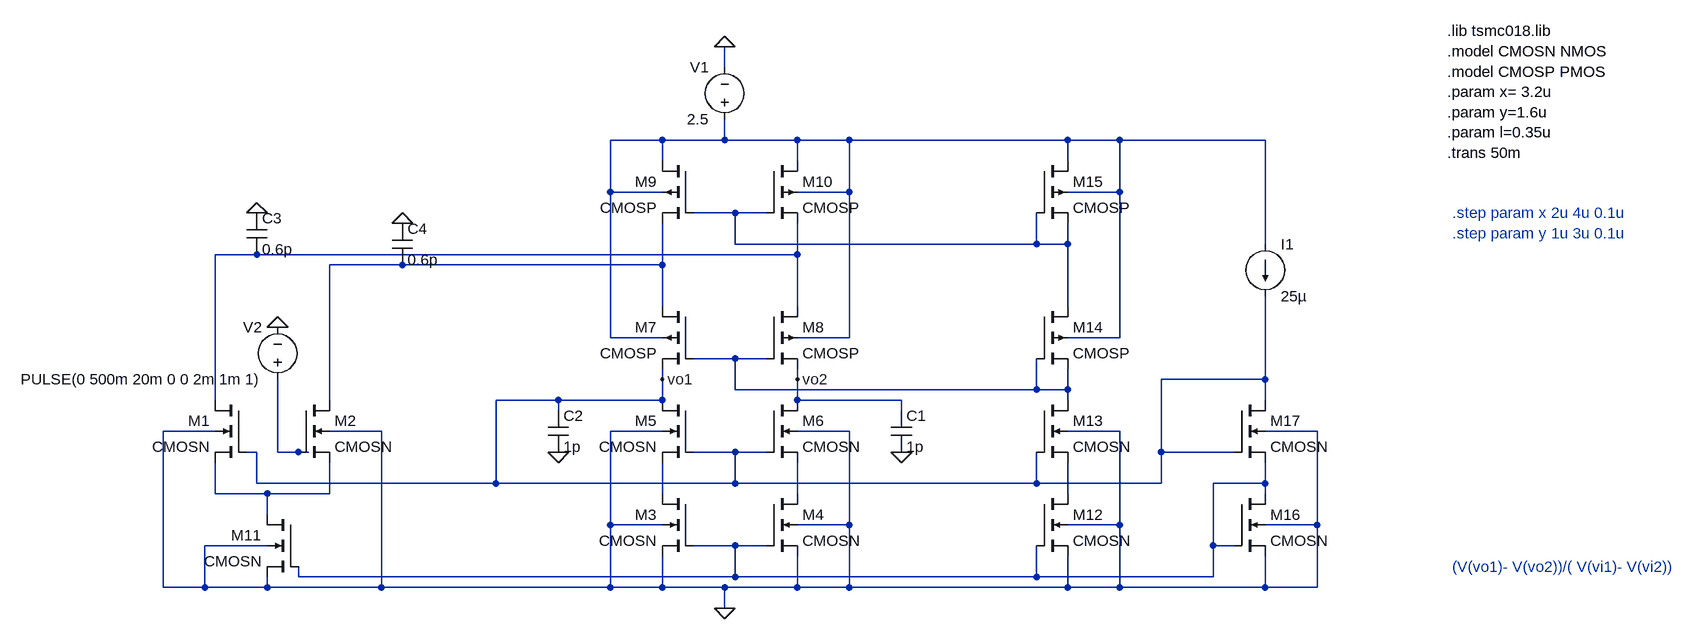
[diagram p0: schematic Draft1 - Slew.asc]
Draft1 - Slew.asc, the LTspice schematic file:
Version 4
SHEET 1 2420 2676
WIRE 624 -512 624 -544
WIRE 528 -400 448 -400
WIRE 624 -400 624 -432
WIRE 624 -400 528 -400
WIRE 736 -400 624 -400
WIRE 816 -400 736 -400
WIRE 1152 -400 816 -400
WIRE 1232 -400 1152 -400
WIRE 1456 -400 1232 -400
WIRE 528 -368 528 -400
WIRE 736 -368 736 -400
WIRE 1152 -368 1152 -400
WIRE 448 -320 448 -400
WIRE 528 -320 448 -320
WIRE 816 -320 816 -400
WIRE 816 -320 736 -320
WIRE 1232 -320 1232 -400
WIRE 1232 -320 1152 -320
WIRE 640 -288 576 -288
WIRE 688 -288 640 -288
WIRE 640 -240 640 -288
WIRE 1104 -240 1104 -288
WIRE 1104 -240 640 -240
WIRE 1152 -240 1152 -272
WIRE 1152 -240 1104 -240
WIRE 1456 -240 1456 -400
WIRE -96 -224 -160 -224
WIRE 736 -224 736 -272
WIRE 736 -224 -96 -224
WIRE 128 -208 16 -208
WIRE 528 -208 528 -272
WIRE 528 -208 128 -208
WIRE 528 -144 528 -208
WIRE 736 -144 736 -224
WIRE 1152 -144 1152 -240
WIRE 448 -96 448 -320
WIRE 528 -96 448 -96
WIRE 816 -96 816 -320
WIRE 816 -96 736 -96
WIRE 1232 -96 1232 -320
WIRE 1232 -96 1152 -96
WIRE 640 -64 576 -64
WIRE 688 -64 640 -64
WIRE 528 -32 528 -48
WIRE 736 -32 736 -48
WIRE 1456 -32 1456 -160
WIRE 1456 -32 1296 -32
WIRE 640 -16 640 -64
WIRE 1104 -16 1104 -64
WIRE 1104 -16 640 -16
WIRE 1152 -16 1152 -48
WIRE 1152 -16 1104 -16
WIRE -160 0 -160 -224
WIRE 16 0 16 -208
WIRE 368 0 272 0
WIRE 528 0 528 -32
WIRE 528 0 368 0
WIRE 736 0 736 -32
WIRE 896 0 736 0
WIRE 1152 0 1152 -16
WIRE 1456 0 1456 -32
WIRE 368 16 368 0
WIRE 736 16 736 0
WIRE 896 16 896 0
WIRE -160 48 -240 48
WIRE 96 48 16 48
WIRE 528 48 448 48
WIRE 816 48 736 48
WIRE 1232 48 1152 48
WIRE 1536 48 1456 48
WIRE -96 80 -112 80
WIRE -64 80 -64 -32
WIRE -32 80 -64 80
WIRE -16 80 -32 80
WIRE 640 80 576 80
WIRE 688 80 640 80
WIRE 1296 80 1296 -32
WIRE 1408 80 1296 80
WIRE -96 128 -96 80
WIRE 272 128 272 0
WIRE 272 128 -96 128
WIRE 640 128 640 80
WIRE 640 128 272 128
WIRE 1104 128 1104 80
WIRE 1104 128 640 128
WIRE 1296 128 1296 80
WIRE 1296 128 1104 128
WIRE 1456 128 1456 96
WIRE 1456 128 1376 128
WIRE -160 144 -160 96
WIRE -80 144 -160 144
WIRE 16 144 16 96
WIRE 16 144 -80 144
WIRE 528 144 528 96
WIRE 736 144 736 96
WIRE 1152 144 1152 96
WIRE 1456 144 1456 128
WIRE -80 176 -80 144
WIRE 448 192 448 48
WIRE 528 192 448 192
WIRE 816 192 816 48
WIRE 816 192 736 192
WIRE 1232 192 1232 48
WIRE 1232 192 1152 192
WIRE 1536 192 1536 48
WIRE 1536 192 1456 192
WIRE -80 224 -176 224
WIRE 640 224 576 224
WIRE 688 224 640 224
WIRE 1376 224 1376 128
WIRE 1408 224 1376 224
WIRE -32 272 -32 256
WIRE 640 272 640 224
WIRE 640 272 -32 272
WIRE 1104 272 1104 224
WIRE 1104 272 640 272
WIRE 1376 272 1376 224
WIRE 1376 272 1104 272
WIRE -240 288 -240 48
WIRE -176 288 -176 224
WIRE -176 288 -240 288
WIRE -80 288 -80 272
WIRE -80 288 -176 288
WIRE 96 288 96 48
WIRE 96 288 -80 288
WIRE 448 288 448 192
WIRE 448 288 96 288
WIRE 528 288 528 240
WIRE 528 288 448 288
WIRE 624 288 528 288
WIRE 736 288 736 240
WIRE 736 288 624 288
WIRE 816 288 816 192
WIRE 816 288 736 288
WIRE 1152 288 1152 240
WIRE 1152 288 816 288
WIRE 1232 288 1232 192
WIRE 1232 288 1152 288
WIRE 1456 288 1456 240
WIRE 1456 288 1232 288
WIRE 1536 288 1536 192
WIRE 1536 288 1456 288
WIRE 624 320 624 288
FLAG 624 320 0
FLAG 624 -544 0
FLAG 528 -32 vo1
FLAG 736 -32 vo2
FLAG 368 80 0
FLAG 896 80 0
FLAG -64 -112 0
FLAG -96 -288 0
FLAG 128 -272 0
SYMBOL nmos4 -32 0 R0
SYMATTR InstName M2
SYMATTR Value CMOSN
SYMATTR Value2 l={l} w={x}
SYMBOL nmos4 -112 0 M0
SYMATTR InstName M1
SYMATTR Value CMOSN
SYMATTR Value2 l={l} w={x}
SYMBOL nmos4 576 144 M0
SYMATTR InstName M3
SYMATTR Value CMOSN
SYMATTR Value2 l={l} w={x}
SYMBOL nmos4 688 144 R0
SYMATTR InstName M4
SYMATTR Value CMOSN
SYMATTR Value2 l={l} w={x}
SYMBOL nmos4 576 0 M0
SYMATTR InstName M5
SYMATTR Value CMOSN
SYMATTR Value2 l={l} w={x}
SYMBOL nmos4 688 0 R0
SYMATTR InstName M6
SYMATTR Value CMOSN
SYMATTR Value2 l={l} w={x}
SYMBOL nmos4 -32 176 M0
SYMATTR InstName M11
SYMATTR Value CMOSN
SYMATTR Value2 l={l} w={2*x}
SYMBOL pmos4 576 -144 M0
SYMATTR InstName M7
SYMATTR Value CMOSP
SYMATTR Value2 l={l} w={y}
SYMBOL pmos4 688 -144 R0
SYMATTR InstName M8
SYMATTR Value CMOSP
SYMATTR Value2 l={l} w={y}
SYMBOL pmos4 688 -368 R0
SYMATTR InstName M10
SYMATTR Value CMOSP
SYMATTR Value2 l={l} w={2*y}
SYMBOL pmos4 576 -368 M0
SYMATTR InstName M9
SYMATTR Value CMOSP
SYMATTR Value2 l={l} w={2*y}
SYMBOL voltage 624 -416 R180
WINDOW 0 24 96 Left 2
WINDOW 3 24 16 Left 2
WINDOW 123 0 0 Left 0
WINDOW 39 0 0 Left 0
SYMATTR InstName V1
SYMATTR Value 2.5
SYMBOL nmos4 1104 144 R0
SYMATTR InstName M12
SYMATTR Value CMOSN
SYMATTR Value2 l={l} w={x}
SYMBOL nmos4 1104 0 R0
SYMATTR InstName M13
SYMATTR Value CMOSN
SYMATTR Value2 l={l} w={x}
SYMBOL pmos4 1104 -144 R0
SYMATTR InstName M14
SYMATTR Value CMOSP
SYMATTR Value2 l={l} w={y}
SYMBOL pmos4 1104 -368 R0
SYMATTR InstName M15
SYMATTR Value CMOSP
SYMATTR Value2 l={l} w={y}
SYMBOL nmos4 1408 144 R0
SYMATTR InstName M16
SYMATTR Value CMOSN
SYMATTR Value2 l={l} w={x}
SYMBOL nmos4 1408 0 R0
SYMATTR InstName M17
SYMATTR Value CMOSN
SYMATTR Value2 l={l} w={x}
SYMBOL current 1456 -240 R0
WINDOW 123 0 0 Left 0
WINDOW 39 0 0 Left 0
SYMATTR InstName I1
SYMATTR Value 25µ
SYMBOL cap 880 16 R0
SYMATTR InstName C1
SYMATTR Value 1p
SYMBOL cap 352 16 R0
SYMATTR InstName C2
SYMATTR Value 1p
SYMBOL voltage -64 -16 R180
WINDOW 0 24 96 Left 2
WINDOW 3 24 16 Left 2
WINDOW 123 0 0 Left 0
WINDOW 39 0 0 Left 0
SYMATTR InstName V2
SYMATTR Value PULSE(0 500m 20m 0 0 2m 1m 1)
SYMBOL cap -112 -288 R0
SYMATTR InstName C3
SYMATTR Value 0.6p
SYMBOL cap 112 -272 R0
SYMATTR InstName C4
SYMATTR Value 0.6p
TEXT 1736 -568 Left 2 !.lib tsmc018.lib\n.model CMOSN NMOS\n.model CMOSP PMOS\n.param x= 3.2u\n.param y=1.6u\n.param l=0.35u\n.trans 50m
TEXT 1744 256 Left 2 ;(V(vo1)- V(vo2))/( V(vi1)- V(vi2))
TEXT 1744 -288 Left 2 ;.step param x 2u 4u 0.1u \n.step param y 1u 3u 0.1u

The netlist it stands for:
* Draft1 - Slew.asc
M2 N004 N006 N008 0 CMOSN l={l} w={x}
M1 N003 vo1 N008 0 CMOSN l={l} w={x}
M3 N009 N007 0 0 CMOSN l={l} w={x}
M4 N010 N007 0 0 CMOSN l={l} w={x}
M5 vo1 vo1 N009 0 CMOSN l={l} w={x}
M6 vo2 vo1 N010 0 CMOSN l={l} w={x}
M11 N008 N007 0 0 CMOSN l={l} w={2*x}
M7 N004 N005 vo1 N001 CMOSP l={l} w={y}
M8 N003 N005 vo2 N001 CMOSP l={l} w={y}
M10 N001 N002 N003 N001 CMOSP l={l} w={2*y}
M9 N001 N002 N004 N001 CMOSP l={l} w={2*y}
V1 N001 0 2.5
M12 N011 N007 0 0 CMOSN l={l} w={x}
M13 N005 vo1 N011 0 CMOSN l={l} w={x}
M14 N002 N005 N005 N001 CMOSP l={l} w={y}
M15 N001 N002 N002 N001 CMOSP l={l} w={y}
M16 N007 N007 0 0 CMOSN l={l} w={x}
M17 vo1 vo1 N007 0 CMOSN l={l} w={x}
I1 N001 vo1 25µ
C1 vo2 0 1p
C2 vo1 0 1p
V2 N006 0 PULSE(0 500m 20m 0 0 2m 1m 1)
C3 0 N003 0.6p
C4 0 N004 0.6p
.model NMOS NMOS
.model PMOS PMOS
.lib standard.mos
.lib tsmc018.lib
.model CMOSN NMOS
.model CMOSP PMOS
.param x= 3.2u
.param y=1.6u
.param l=0.35u
.trans 50m
* (V(vo1)- V(vo2))/( V(vi1)- V(vi2))
* .step param x 2u 4u 0.1u
* .step param y 1u 3u 0.1u
.backanno
.end